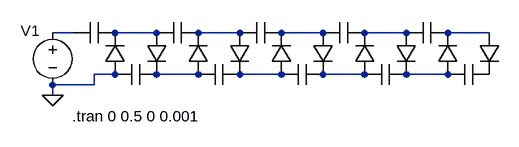
[diagram p0: schematic voltage_multiplier.asc]
voltage_multiplier.asc, the LTspice schematic file:
Version 4
SHEET 1 880 680
WIRE 128 64 96 64
WIRE 256 64 192 64
WIRE 384 64 320 64
WIRE 512 64 448 64
WIRE 640 64 576 64
WIRE 768 64 704 64
WIRE 192 128 160 128
WIRE 320 128 256 128
WIRE 448 128 384 128
WIRE 576 128 512 128
WIRE 704 128 640 128
WIRE 160 144 160 128
WIRE 160 144 96 144
WIRE 96 160 96 144
FLAG 96 160 0
SYMBOL voltage 96 48 R0
WINDOW 0 -49 13 Left 2
WINDOW 3 24 96 Invisible 2
WINDOW 123 0 0 Left 0
WINDOW 39 0 0 Left 0
SYMATTR InstName V1
SYMATTR Value SINE(0 155.56 1000)
SYMBOL cap 128 80 R270
WINDOW 0 32 32 Invisible 2
WINDOW 3 0 32 Invisible 2
SYMATTR InstName C1
SYMATTR Value 330p
SYMBOL diode 208 128 R180
WINDOW 0 24 64 Invisible 2
WINDOW 3 24 0 Invisible 2
SYMATTR InstName D1
SYMBOL cap 192 144 R270
WINDOW 0 32 32 Invisible 2
WINDOW 3 0 32 Invisible 2
SYMATTR InstName C2
SYMATTR Value 330p
SYMBOL diode 240 64 R0
WINDOW 0 24 0 Invisible 2
WINDOW 3 24 64 Invisible 2
SYMATTR InstName D2
SYMBOL diode 336 128 R180
WINDOW 0 24 64 Invisible 2
WINDOW 3 24 0 Invisible 2
SYMATTR InstName D3
SYMBOL cap 320 144 R270
WINDOW 0 32 32 Invisible 2
WINDOW 3 0 32 Invisible 2
SYMATTR InstName C3
SYMATTR Value 330p
SYMBOL diode 368 64 R0
WINDOW 0 24 0 Invisible 2
WINDOW 3 24 64 Invisible 2
SYMATTR InstName D4
SYMBOL cap 256 80 R270
WINDOW 0 32 32 Invisible 2
WINDOW 3 0 32 Invisible 2
SYMATTR InstName C4
SYMATTR Value 330p
SYMBOL diode 464 128 R180
WINDOW 0 24 64 Invisible 2
WINDOW 3 24 0 Invisible 2
SYMATTR InstName D5
SYMBOL cap 448 144 R270
WINDOW 0 32 32 Invisible 2
WINDOW 3 0 32 Invisible 2
SYMATTR InstName C5
SYMATTR Value 330p
SYMBOL diode 496 64 R0
WINDOW 0 24 0 Invisible 2
WINDOW 3 24 64 Invisible 2
SYMATTR InstName D6
SYMBOL cap 384 80 R270
WINDOW 0 32 32 Invisible 2
WINDOW 3 0 32 Invisible 2
SYMATTR InstName C6
SYMATTR Value 330p
SYMBOL diode 592 128 R180
WINDOW 0 24 64 Invisible 2
WINDOW 3 24 0 Invisible 2
SYMATTR InstName D7
SYMBOL cap 576 144 R270
WINDOW 0 32 32 Invisible 2
WINDOW 3 0 32 Invisible 2
SYMATTR InstName C7
SYMATTR Value 330p
SYMBOL diode 624 64 R0
WINDOW 0 24 0 Invisible 2
WINDOW 3 24 64 Invisible 2
SYMATTR InstName D8
SYMBOL cap 512 80 R270
WINDOW 0 32 32 Invisible 2
WINDOW 3 0 32 Invisible 2
SYMATTR InstName C8
SYMATTR Value 330p
SYMBOL diode 720 128 R180
WINDOW 0 24 64 Invisible 2
WINDOW 3 24 0 Invisible 2
SYMATTR InstName D9
SYMBOL cap 704 144 R270
WINDOW 0 32 32 Invisible 2
WINDOW 3 0 32 Invisible 2
SYMATTR InstName C9
SYMATTR Value 330p
SYMBOL diode 752 64 R0
WINDOW 0 24 0 Invisible 2
WINDOW 3 24 64 Invisible 2
SYMATTR InstName D10
SYMBOL cap 640 80 R270
WINDOW 0 32 32 Invisible 2
WINDOW 3 0 32 Invisible 2
SYMATTR InstName C10
SYMATTR Value 330p
TEXT 126 192 Left 2 !.tran 0 0.5 0 0.001

The netlist it stands for:
* voltage_multiplier.asc
V1 N001 0 SINE(0 155.56 1000)
C1 N001 N002 330p
D1 0 N002 D
C2 0 N007 330p
D2 N002 N007 D
D3 N007 N003 D
C3 N007 N008 330p
D4 N003 N008 D
C4 N002 N003 330p
D5 N008 N004 D
C5 N008 N009 330p
D6 N004 N009 D
C6 N003 N004 330p
D7 N009 N005 D
C7 N009 N010 330p
D8 N005 N010 D
C8 N004 N005 330p
D9 N010 N006 D
C9 N010 P001 330p
D10 N006 P001 D
C10 N005 N006 330p
.model D D
.lib standard.dio
.tran 0 0.5 0 0.001
.backanno
.end